# Altium project 全志-Linux.PrjPCB
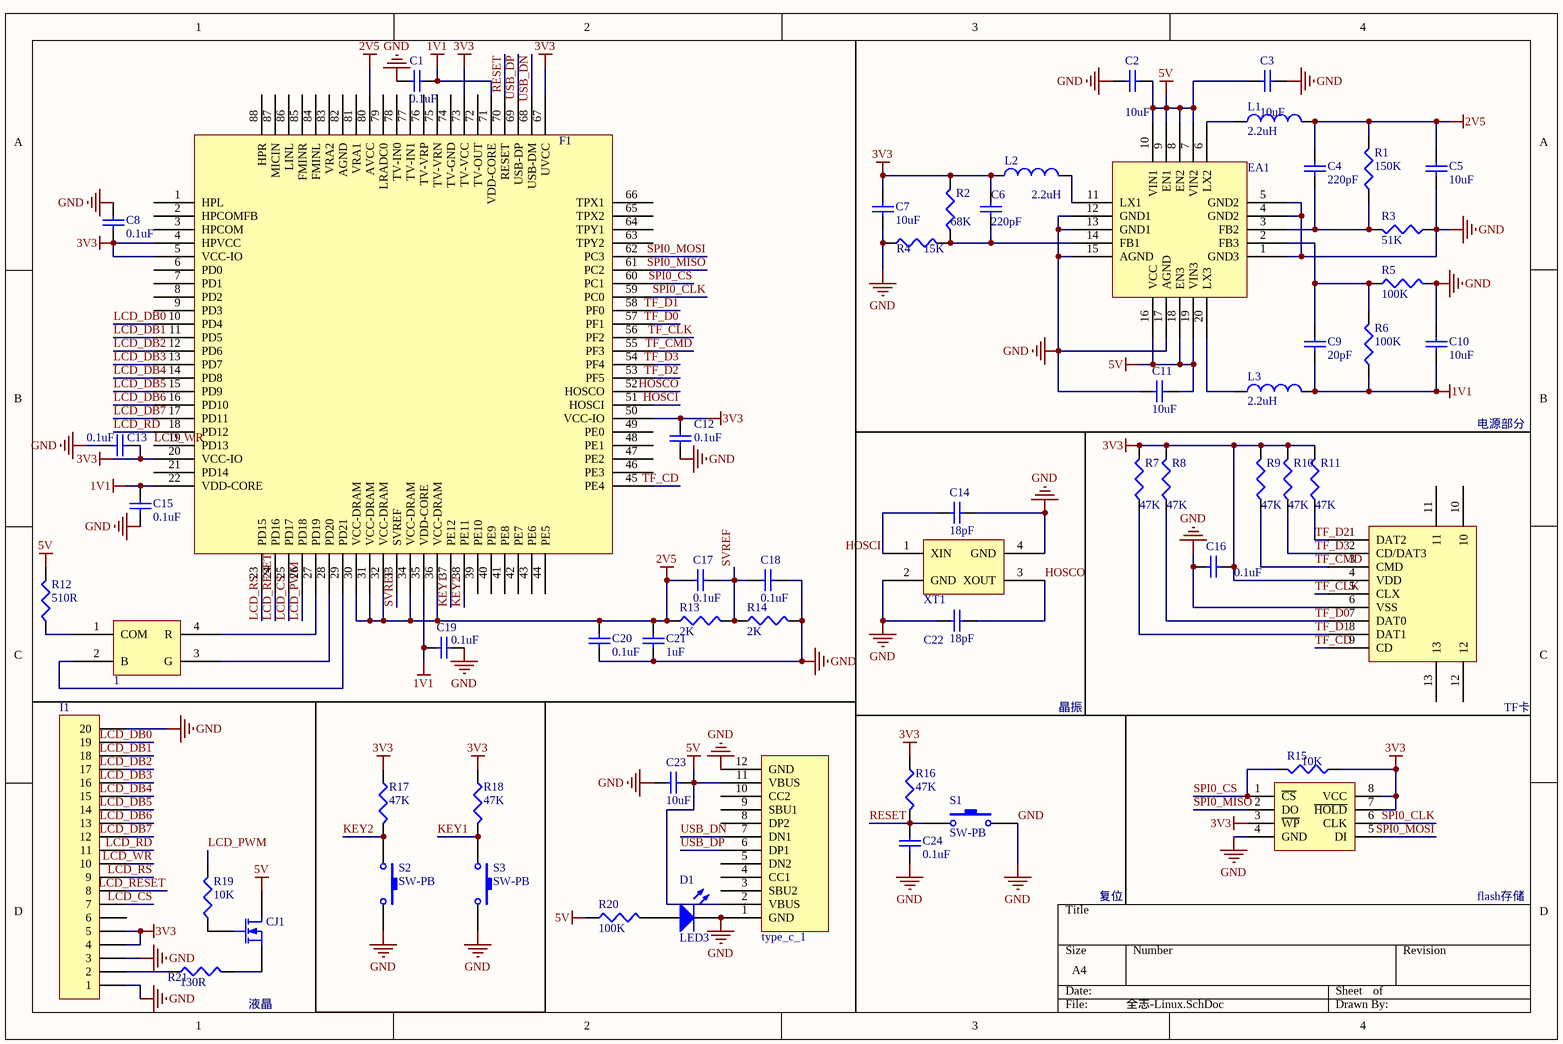
[diagram p0: 全志-Linux.SchDoc]
1 sheet, 61 parts. Net scope: global (net labels, ports and power ports of the same name join across sheets).
Board files: 全志-Linux.PcbDoc, 全志-Linux-85.PcbDoc

## Sheet 全志-Linux.SchDoc
size A4

### Parts
1  1615RGB  [1615RGB]  (value not drawn)
*1  tf卡  [tf卡座]  (value not drawn)
C1  value 0.1uF  [C0402]  (hidden comment: Cap Semi)
C2  value 10uF  [C0603]  (hidden comment: Cap Semi)
C3  value 10uF  [C0603]  (hidden comment: Cap Semi)
C4  value 220pF  [C0402]  (hidden comment: Cap Semi)
C5  value 10uF  [C0603]  (hidden comment: Cap Semi)
C6  value 220pF  [C0402]  (hidden comment: Cap Semi)
C7  value 10uF  [C0603]  (hidden comment: Cap Semi)
C8  value 0.1uF  [C0402]  (hidden comment: Cap Semi)
C9  value 20pF  [C0402]  (hidden comment: Cap Semi)
C10  value 10uF  [C0603]  (hidden comment: Cap Semi)
C11  value 10uF  [C0603]  (hidden comment: Cap Semi)
C12  value 0.1uF  [C0402]  (hidden comment: Cap Semi)
C13  value 0.1uF  [C0402]  (hidden comment: Cap Semi)
C14  value 18pF  [C0402]  (hidden comment: Cap Semi)
C15  value 0.1uF  [C0402]  (hidden comment: Cap Semi)
C16  value 0.1uF  [C0402]  (hidden comment: Cap Semi)
C17  value 0.1uF  [C0402]  (hidden comment: Cap Semi)
C18  value 0.1uF  [C0402]  (hidden comment: Cap Semi)
C19  value 0.1uF  [C0402]  (hidden comment: Cap Semi)
C20  value 0.1uF  [C0402]  (hidden comment: Cap Semi)
C21  value 1uF  [C0402]  (hidden comment: Cap Semi)
C22  value 18pF  [C0402]  (hidden comment: Cap Semi)
C23  value 10uF  [C0603]  (hidden comment: Cap Semi)
C24  value 0.1uF  [C0402]  (hidden comment: Cap Semi)
CJ1  MOSFET-N  [SOT23]  (value not drawn)
D1  LED3  [LED0402 R]
EA1  EA3036  [QFN20-3mm]  (value not drawn)
F1  F1C100S  [QFN88]  (value not drawn)
I1  Header 20  [20P液晶]  (value not drawn)
L1  value 2.2uH  [L0805]  (hidden comment: Inductor)
L2  value 2.2uH  [L0805]  (hidden comment: Inductor)
L3  value 2.2uH  [L0805]  (hidden comment: Inductor)
R1  value 150K  [R0402]  (hidden comment: Res3)
R2  value 68K  [R0402]  (hidden comment: Res3)
R3  value 51K  [R0402]  (hidden comment: Res3)
R4  value 15K  [R0402]  (hidden comment: Res3)
R5  value 100K  [R0402]  (hidden comment: Res3)
R6  value 100K  [R0402]  (hidden comment: Res3)
R7  value 47K  [R0402]  (hidden comment: Res3)
R8  value 47K  [R0402]  (hidden comment: Res3)
R9  value 47K  [R0402]  (hidden comment: Res3)
R10  value 47K  [R0402]  (hidden comment: Res3)
R11  value 47K  [R0402]  (hidden comment: Res3)
R12  value 510R  [R0402]  (hidden comment: Res3)
R13  value 2K  [R0402]  (hidden comment: Res3)
R14  value 2K  [R0402]  (hidden comment: Res3)
R15  value 10K  [R0402]  (hidden comment: Res3)
R16  value 47K  [R0402]  (hidden comment: Res3)
R17  value 47K  [R0402]  (hidden comment: Res3)
R18  value 47K  [R0402]  (hidden comment: Res3)
R19  value 10K  [R0402]  (hidden comment: Res3)
R20  value 100K  [R0402]  (hidden comment: Res3)
R21  value 130R  [R0402]  (hidden comment: Res3)
S1  SW-PB  [3*4*2.0小龟按键]
S2  SW-PB  [轻触按键2*4*3.5]
S3  SW-PB  [轻触按键2*4*3.5]
type_c_1  type_c_16  [type_c_16]  (value not drawn)
W1  W25Qxx  [SOP8]  (value not drawn)
XT1  XT3225晶振  [XTAL-3225]  (value not drawn)

### Nets
1V1: C1.1 C9.1 C10.1 C15.1 C19.1 F1.22(VDD-CORE) F1.35(VDD-CORE) F1.71(VDD-CORE) L3.2 R6.1
2V5: C4.2 C5.2 C17.2 C20.1 C21.1 F1.30(VCC-DRAM) F1.31(VCC-DRAM) F1.32(VCC-DRAM) F1.34(VCC-DRAM) F1.36(VCC-DRAM) F1.80(AVCC) L1.2 R1.2 R13.1
3V3: *1.4(VDD) C6.2 C7.2 C8.1 C12.1 C13.1 C16.2 F1.4(HPVCC) F1.5(VCC-IO) F1.20(VCC-IO) F1.50(VCC-IO) F1.67(UVCC) F1.73(TV-VCC) I1.4 I1.5 L2.1 R2.2 R7.2 R8.2 R9.2 R10.2 R11.2 R15.1 R16.1 R17.1 R18.1 W1.3(~{WP}) W1.7(~{HOLD}) W1.8(VCC)
5V: C2.2 C3.1 C11.2 C23.1 CJ1.1(D) EA1.7(VIN2) EA1.8(EN2) EA1.9(EN1) EA1.10(VIN1) EA1.16(VCC) EA1.18(EN3) EA1.19(VIN3) R12.2 R20.1 type_c_1.2(VBUS) type_c_1.11(VBUS)
GND: *1.6(VSS) C1.2 C2.1 C3.2 C5.1 C7.1 C8.2 C10.2 C11.1 C12.2 C13.2 C14.2 C15.2 C16.1 C18.1 C19.2 C20.2 C21.2 C22.1 C23.2 C24.2 D1.2(K) EA1.1(GND3) EA1.4(GND2) EA1.5(GND2) EA1.12(GND1) EA1.13(GND1) EA1.15(AGND) EA1.17(AGND) I1.1 I1.3 I1.20 R3.1 R4.1 R5.2 R14.2 S1.2 S2.2 S3.2 type_c_1.1(GND) type_c_1.12(GND) W1.4(GND) XT1.2(GND) XT1.4(GND)
HOSCI: C14.1 F1.51(HOSCI) XT1.1(XIN)
HOSCO: C22.2 F1.52(HOSCO) XT1.3(XOUT)
KEY1: F1.37(PE12) R18.2 S3.1
KEY2: F1.38(PE11) R17.2 S2.1
LCD_CS: F1.25(PD17) I1.7
LCD_DB0: F1.10(PD4) I1.19
LCD_DB1: F1.11(PD5) I1.18
LCD_DB2: F1.12(PD6) I1.17
LCD_DB3: F1.13(PD7) I1.16
LCD_DB4: F1.14(PD8) I1.15
LCD_DB5: F1.15(PD9) I1.14
LCD_DB6: F1.16(PD10) I1.13
LCD_DB7: F1.17(PD11) I1.12
LCD_PWM: F1.26(PD18) R19.2
LCD_RD: F1.18(PD12) I1.11
LCD_RESET: F1.24(PD16) I1.8
LCD_RS: F1.23(PD15) I1.9
LCD_WR: F1.19(PD13) I1.10
RESET: C24.1 F1.70(RESET) R16.2 S1.1
SPI0_CLK: F1.59(PC0) W1.6(CLK)
SPI0_CS: F1.60(PC1) R15.2 W1.1(~{CS})
SPI0_MISO: F1.61(PC2) W1.2(DO)
SPI0_MOSI: F1.62(PC3) W1.5(DI)
SVREF: C17.1 C18.2 F1.33(SVREF) R13.2 R14.1
TF_CD: *1.9(CD) F1.45(PE4)
TF_CLK: *1.5(CLX) F1.56(PF2)
TF_CMD: *1.3(CMD) F1.55(PF3) R9.1
TF_D0: *1.7(DAT0) F1.57(PF1) R8.1
TF_D1: *1.8(DAT1) F1.58(PF0) R7.1
TF_D2: *1.1(DAT2) F1.53(PF5) R11.1
TF_D3: *1.2(CD/DAT3) F1.54(PF4) R10.1
USB_DN: F1.68(USB-DM) type_c_1.7(DN1)
USB_DP: F1.69(USB-DP) type_c_1.6(DP1)
Net1_1: 1.1(COM) R12.1
Net1_2: 1.2(B) F1.29(PD21)
Net1_3: 1.3(G) F1.28(PD20)
Net1_4: 1.4(R) F1.27(PD19)
NetC4_1: C4.1 EA1.3(FB2) R1.1 R3.2
NetC6_1: C6.1 EA1.14(FB1) R2.1 R4.2
NetC9_2: C9.2 EA1.2(FB3) R5.1 R6.2
NetCJ1_2: CJ1.2(G) R19.1
NetCJ1_3: CJ1.3(S) R21.2
NetD1_1: D1.1(A) R20.2
NetEA1_6: EA1.6(LX2) L1.1
NetEA1_11: EA1.11(LX1) L2.2
NetEA1_20: EA1.20(LX3) L3.1
NetI1_2: I1.2 R21.1

Not connected (* = marked no-connect by the designer): *1 10 11 12 13; F1 1(HPL) 2(HPCOMFB) 3(HPCOM) 6(PD0) 7(PD1) 8(PD2) 9(PD3) 21(PD14) 39(PE10) 40(PE9) 41(PE8) 42(PE7) 43(PE6) 44(PE5) 46(PE3) 47(PE2) 48(PE1) 49(PE0) 63(TPY2) 64(TPY1) 65(TPX2) 66(TPX1) 72(TV-OUT) 74(TV-GND) 75(TV-VRN) 76(TV-VRP) 77(TV-IN1) 78(TV-IN0) 79(LRADC0) 81(VRA1) 82(AGND) 83(VRA2) 84(FMINL) 85(FMINR) 86(LINL) 87(MICIN) 88(HPR); I1 6; type_c_1 3(SBU2) 4(CC1) 5(DN2) 8(DP2) 9(SBU1) 10(CC2)

### Notes on the sheet
- 电源部分
- 晶振
- TF卡
- 复位
- flash存储
- 液晶

### Library data of the parts
C1-C24 = Cap Semi: Capacitor (Semiconductor SIM Model); Published: 8-Jun-2000; LatestRevisionDate: 29-May-2009; LatestRevisionNote: IPC-7351 Footprint Added.; PackageReference: C1206; Publisher: Altium Limited; PackageDescription: Chip Capacitor
CJ1 = MOSFET-N: N-Channel MOSFET; Published: 8-Jun-2000; LatestRevisionDate: 17-Jul-2002; LatestRevisionNote: Re-released for DXP Platform.; PackageVersion: 1995/1996; PackageReference: E3; Publisher: Altium Limited; PackageDescription: TO, Flat Index; 3 In-Line, Axial Leads; Body Dia. 4.6mm; Lead Dia. 0.5 mm (max)
D1 = LED3: Typical BLUE SiC LED; Published: 8-Jun-2000; LatestRevisionDate: 17-Dec-2003; LatestRevisionNote: PCB Footprint replaced.; DatasheetVersion: 16-Apr-2002; PackageVersion: 16-Apr-2002; PackageReference: 3.5X2.8X1.9; Publisher: Altium Limited; PackageDescription: SM LED; 2 C-Bend Leads; Body 3.5 x 2.8 x 1.9 mm, inc leads (LxWxH typ)
I1 = Header 20: Header, 20-Pin; LatestRevisionDate: 17-Jul-2002; LatestRevisionNote: Re-released for DXP Platform.; Publisher: Altium Limited
L1-L3 = Inductor: Code_IEC: 1005; Published: 8-Jun-2000; LatestRevisionDate: 29-May-2009; LatestRevisionNote: IPC-7351 Footprint Added.; PackageReference: 0402-A; Publisher: Altium Limited; PackageDescription: Chip Inductor; Code_JEITA: 0402
R1-R21 = Res3: Resistor; Published: 8-Jun-2000; LatestRevisionDate: 29-May-2009; LatestRevisionNote: IPC-7351 Footprint Added.; PackageReference: J1-0603; Publisher: Altium Limited; PackageDescription: Chip Resistor
S1-S3 = SW-PB: Switch; Published: 24-Mar-1999; LatestRevisionDate: 17-Jul-2002; LatestRevisionNote: Re-released for DXP Platform.; PackageReference: SPST-2; Publisher: Altium Limited; PackageDescription: Switch; 2 Leads
W1 = W25Qxx: 外置Flash; 版权归属: 源创客; BOM名称: 外置Flash; 学习资源: www.ooocke.com